# EAGLE design firefly2_auto (EAGLE 5.10)
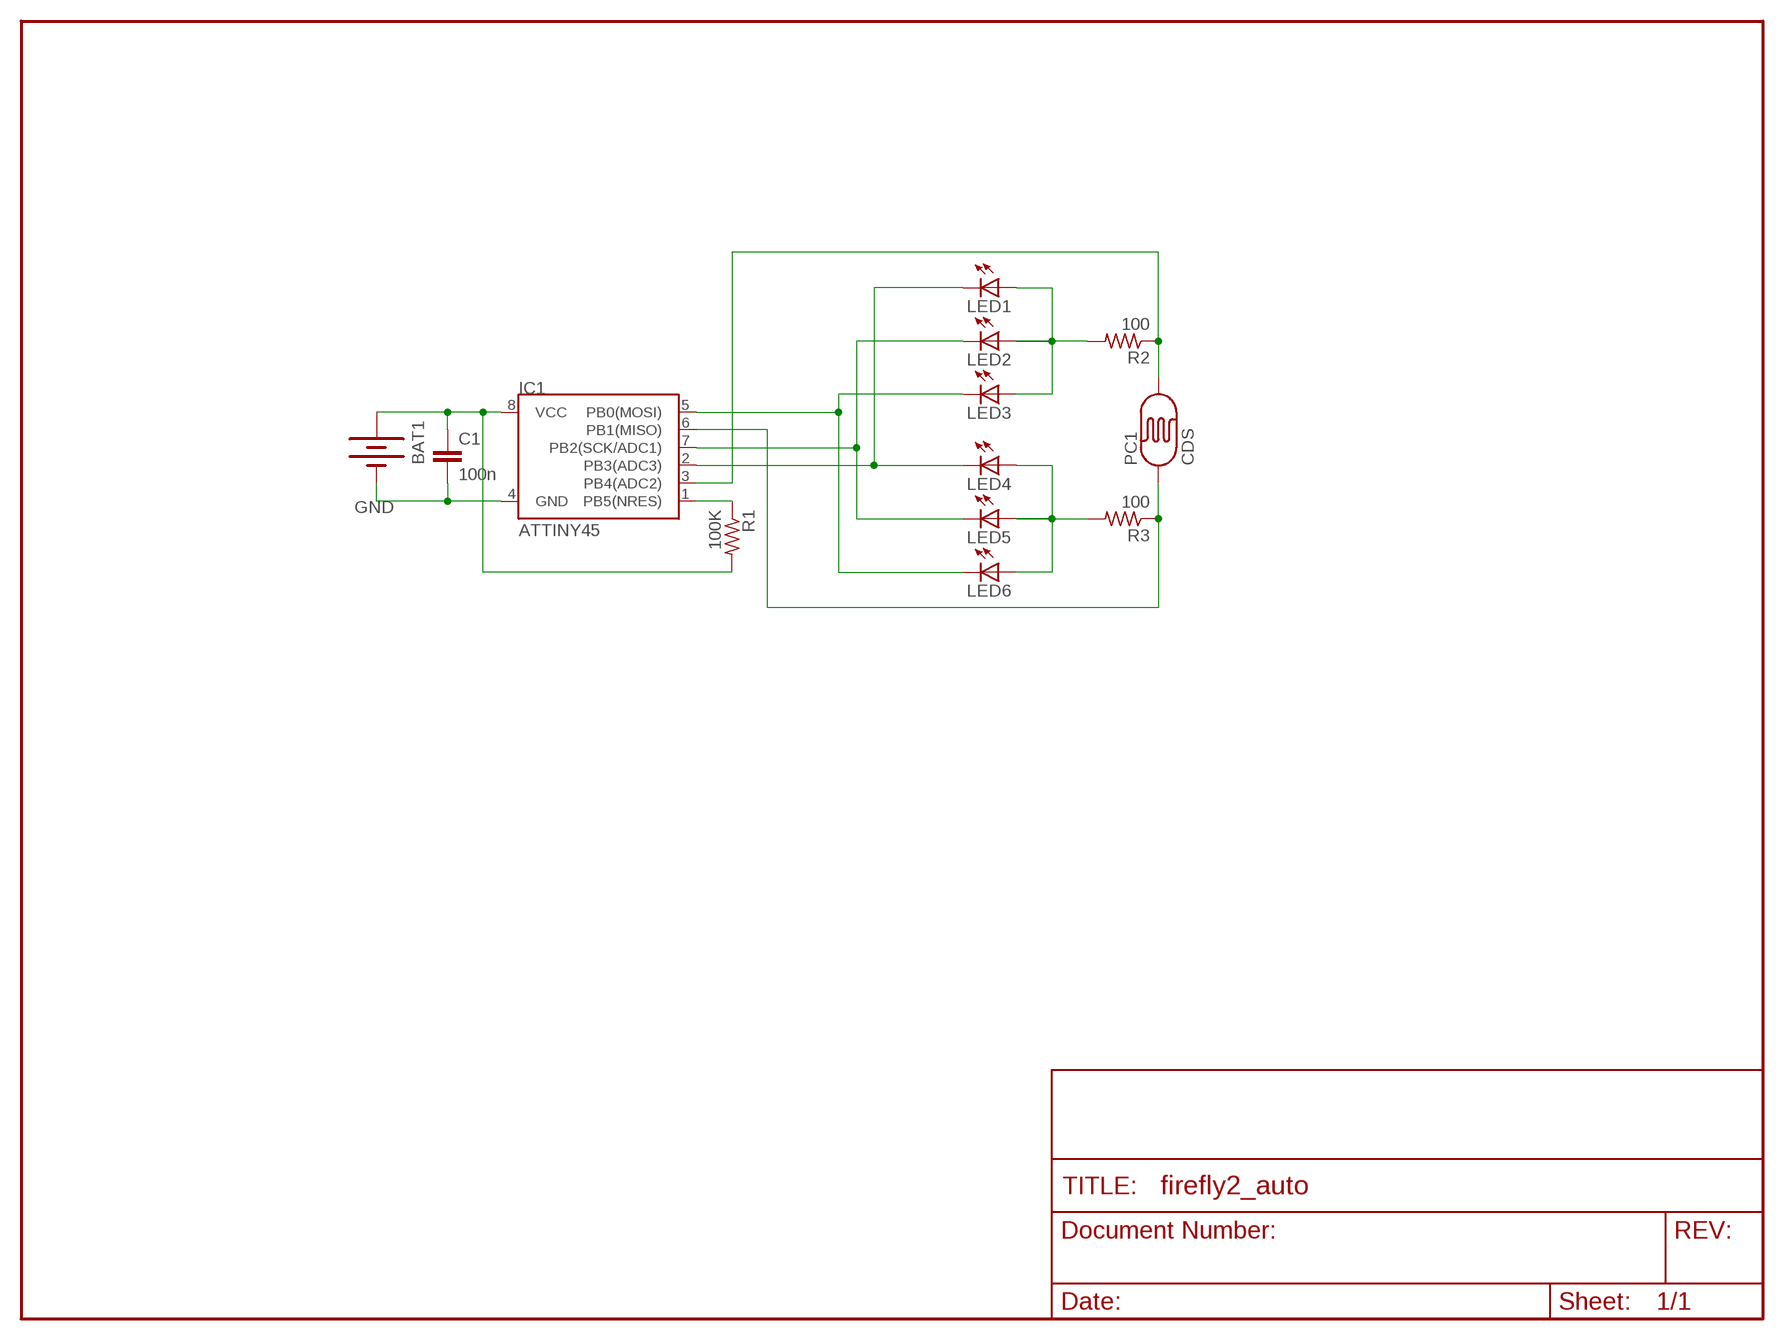
[diagram p0: schematic, sheet 1]

## Parts
BAT1  BATTERY20PTH  [BATTCOM_20MM_PTH]
C1  100n  CAP0805  [R0805]
IC1  ATTINY45  [SO08-EIAJ]
LED1  LED0805  [LED-0805]
LED2  LED0805  [LED-0805]
LED3  LED0805  [LED-0805]
LED4  LED0805  [LED-0805]
LED5  LED0805  [LED-0805]
LED6  LED0805  [LED-0805]
PC1  CDS  PHOTOCELLPTH  [PHOTOCELL]
R1  100K  R-US_R0805  [R0805]
R2  100  R-US_R0805  [R0805]
R3  100  R-US_R0805  [R0805]

## Nets
GND: BAT1.2(-) C1.2 IC1.4(GND)
N$1: IC1.1(PB5(NRES)) R1.1
N$4: IC1.6(PB1(MISO)) PC1.1 R3.1
N$5: LED1.A LED2.A LED3.A R2.2
N$6: LED4.A LED5.A LED6.A R3.2
N$7: IC1.2(PB3(ADC3)) LED1.C LED4.C
N$8: IC1.7(PB2(SCK/ADC1)) LED2.C LED5.C
N$9: IC1.5(PB0(MOSI)) LED3.C LED6.C
N$10: IC1.3(PB4(ADC2)) PC1.2 R2.1
VBATT: BAT1.1(+) C1.1 IC1.8(VCC) R1.2

## Library data of the parts
BAT1 = firefly:BATTERY: Battery Holders Various common sizes : AA, AAA, 20mm coin cell and 12mm coin cell.
C1 = firefly:CAP: Capacitor Standard 0603 ceramic capacitor, and 0.1" leaded capacitor.
IC1 = firefly:ATTINY45: Atmel ATTiny45
LED1-LED6 = firefly:LED: LEDs Standard schematic elements and footprints for 5mm, 3mm, 1206, and 0603 sized LEDs. 5mm - Spark Fun Electronics SKU : COM-00529 (and others)
PC1 = firefly:PHOTOCELL
R1-R3 = firefly:R-US_: RESISTOR, American symbol

## Board
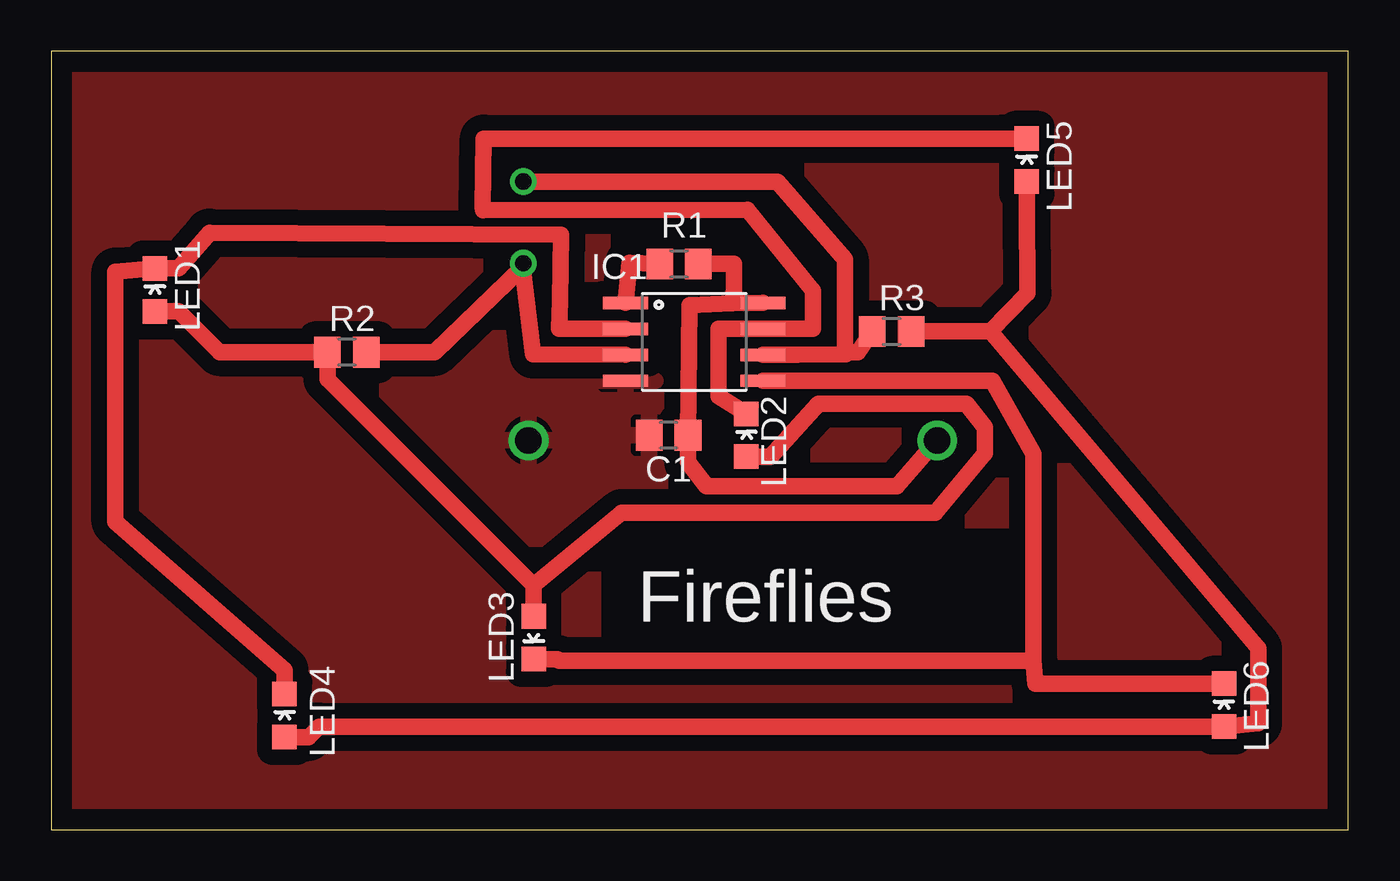
[diagram p1: board, top side]
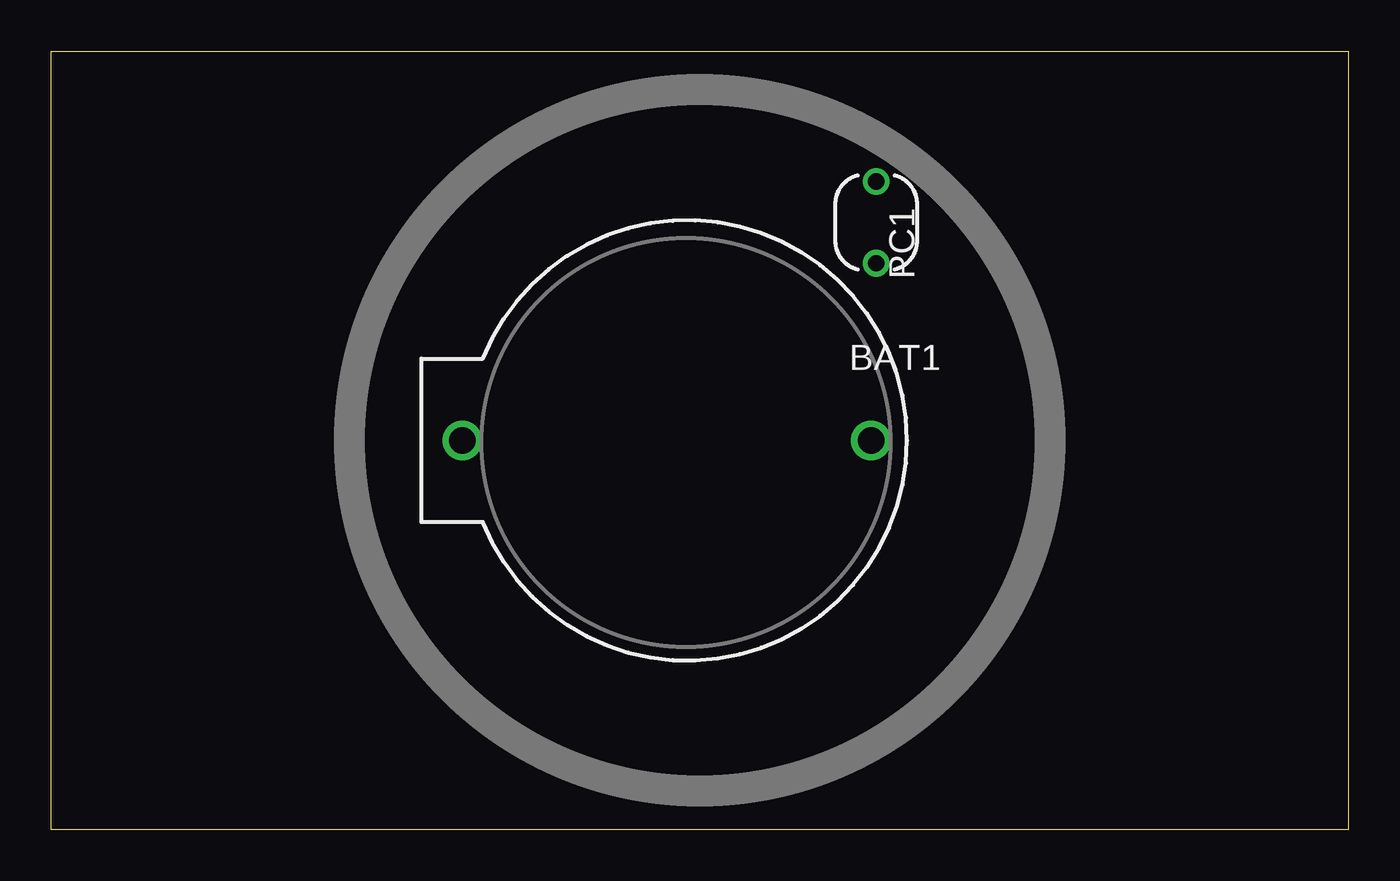
[diagram p2: board, bottom side, seen from below]

Size 63.5 x 38.1 mm. Coordinates in mm from the lower left corner, seen from the top.
Outline: 0,0 63.5,0 63.5,38.1 0,38.1 0,0
Copper layers 1: Top 0.035mm
Design rules "default *": minimum track width 16mil, minimum drill 0.8mm, track to track 10mil, track to pad 10mil, pad to pad 10mil, via to via 10mil, smd to smd 10mil, copper to edge 40mil, drill to drill 10mil, minimum pad ring 10mil, minimum via ring 8mil, stop-mask expansion 4mil, vias tented up to drill 0mil, thermal gap 10mil
tRestrict: area 27.7,8.9 to 46.7,14

### Footprints (pad centres in the part's own frame; a part is rotated, then mirrored left to right if it is on the bottom)
BATTCOM_20MM_PTH = drill 1.295 round: 1 20,0; 2 0,0
R0805 = smd 1.3 x 1.5: 1 -0.95,0; 2 0.95,0
SO08-EIAJ = smd 0.61 x 2.21: 1 -1.905,-3.378; 2 -0.635,-3.378; 3 0.635,-3.378; 4 1.905,-3.378; 5 1.905,3.353; 6 0.635,3.353; 7 -0.635,3.353; 8 -1.905,3.353
LED-0805 = smd 1.2 x 1.2: A 0,-1.05; C 0,1.05
PHOTOCELL = drill 0.8 round: 1 -2,0; 2 2,0

### Placement (x,y rotation side)
BAT1  23.37,19.05 180 bottom
C1  30.23,19.3 180 top
IC1  31.5,23.88 270 top
LED1  5.08,26.42 0 top
LED2  34.04,19.3 0 top
LED3  23.62,9.4 180 top
LED4  11.43,5.59 0 top
LED5  47.75,32.77 0 top
LED6  57.4,6.1 0 top
PC1  23.11,29.72 270 bottom
R1  30.73,27.69 0 top
R2  14.48,23.37 180 top
R3  41.15,24.38 0 top

### Tracks (layer width: path | path; a pad name or v marks a point on that pad's centre or on a via)
GND
  pour Top (isolate 0.762): 0,38.1 63.5,38.1 63.5,22.35 63.5,0 0,0
N$1
  Top 0.813: R1.1 29.58,27.69 28.31,27.75 IC1.1
N$4
  Top 0.813: 38.85,23.37 38.91,23.27 36.52,23.24 IC1.6 | 38.85,23.37 39.48,23.37 R3.1 | 38.85,23.37 38.85,27.91 35.56,31.72 PC1.1
N$5
  Top 0.813: 23.62,11.95 23.62,11.03 LED3.A | 23.62,11.95 13.53,22.05 R2.2 8.25,23.37 6.25,25.37 LED1.A | 23.62,11.95 27.93,15.5 43.27,15.5 45.7,18.43 45.7,19.7 44.8,20.86 37.55,20.86 35.21,18.25 LED2.A
N$6
  Top 0.813: LED5.A 47.75,30.54 47.79,26.26 45.97,24.38 | 45.97,24.38 R3.2 | 45.97,24.38 59.08,8.87 59.08,5.2 LED6.A 13.11,5.05 12.6,4.54 LED4.A
N$7
  Top 0.813: LED4.C 11.43,7.81 3.15,15.08 3.15,27.31 LED1.C 6.25,27.47 7.75,29.22 24.96,29.12 24.92,25.89 24.87,24.51 IC1.2
N$8
  Top 0.813: LED2.C 32.66,21.22 32.66,24.51 IC1.7 35.65,24.51 37.29,24.51 37.29,26.37 34.09,30.33 21.13,30.3 21.13,30.48 21.12,30.43 21.18,33.82 46.58,33.82 LED5.C
N$9
  Top 0.813: 48.07,8.27 48.07,18.41 46.08,21.97 IC1.5 | LED6.C 48.18,7.15 48.07,8.27 | 48.07,8.27 24.87,8.27 24.79,8.35 LED3.C
N$10
  Top 0.813: 23.07,27.52 PC1.2 | R2.1 18.76,23.37 23.07,27.52 | 23.07,27.52 23.6,23.27 IC1.3
VBATT
  Top 0.813: BAT1.1 41.39,16.82 32.09,16.82 31.18,17.98 C1.1 31.24,25.65 33.34,25.76 | 33.34,25.76 33.41,26.45 33.41,27.69 R1.2 | 33.34,25.76 IC1.8

### Text on the board
tPlace: Fireflies